# Altium project BACKPMAN21.PrjPcb (part 3 of 3)

## Sheet BACKPMAN21_PwrSw.SchDoc
size A3
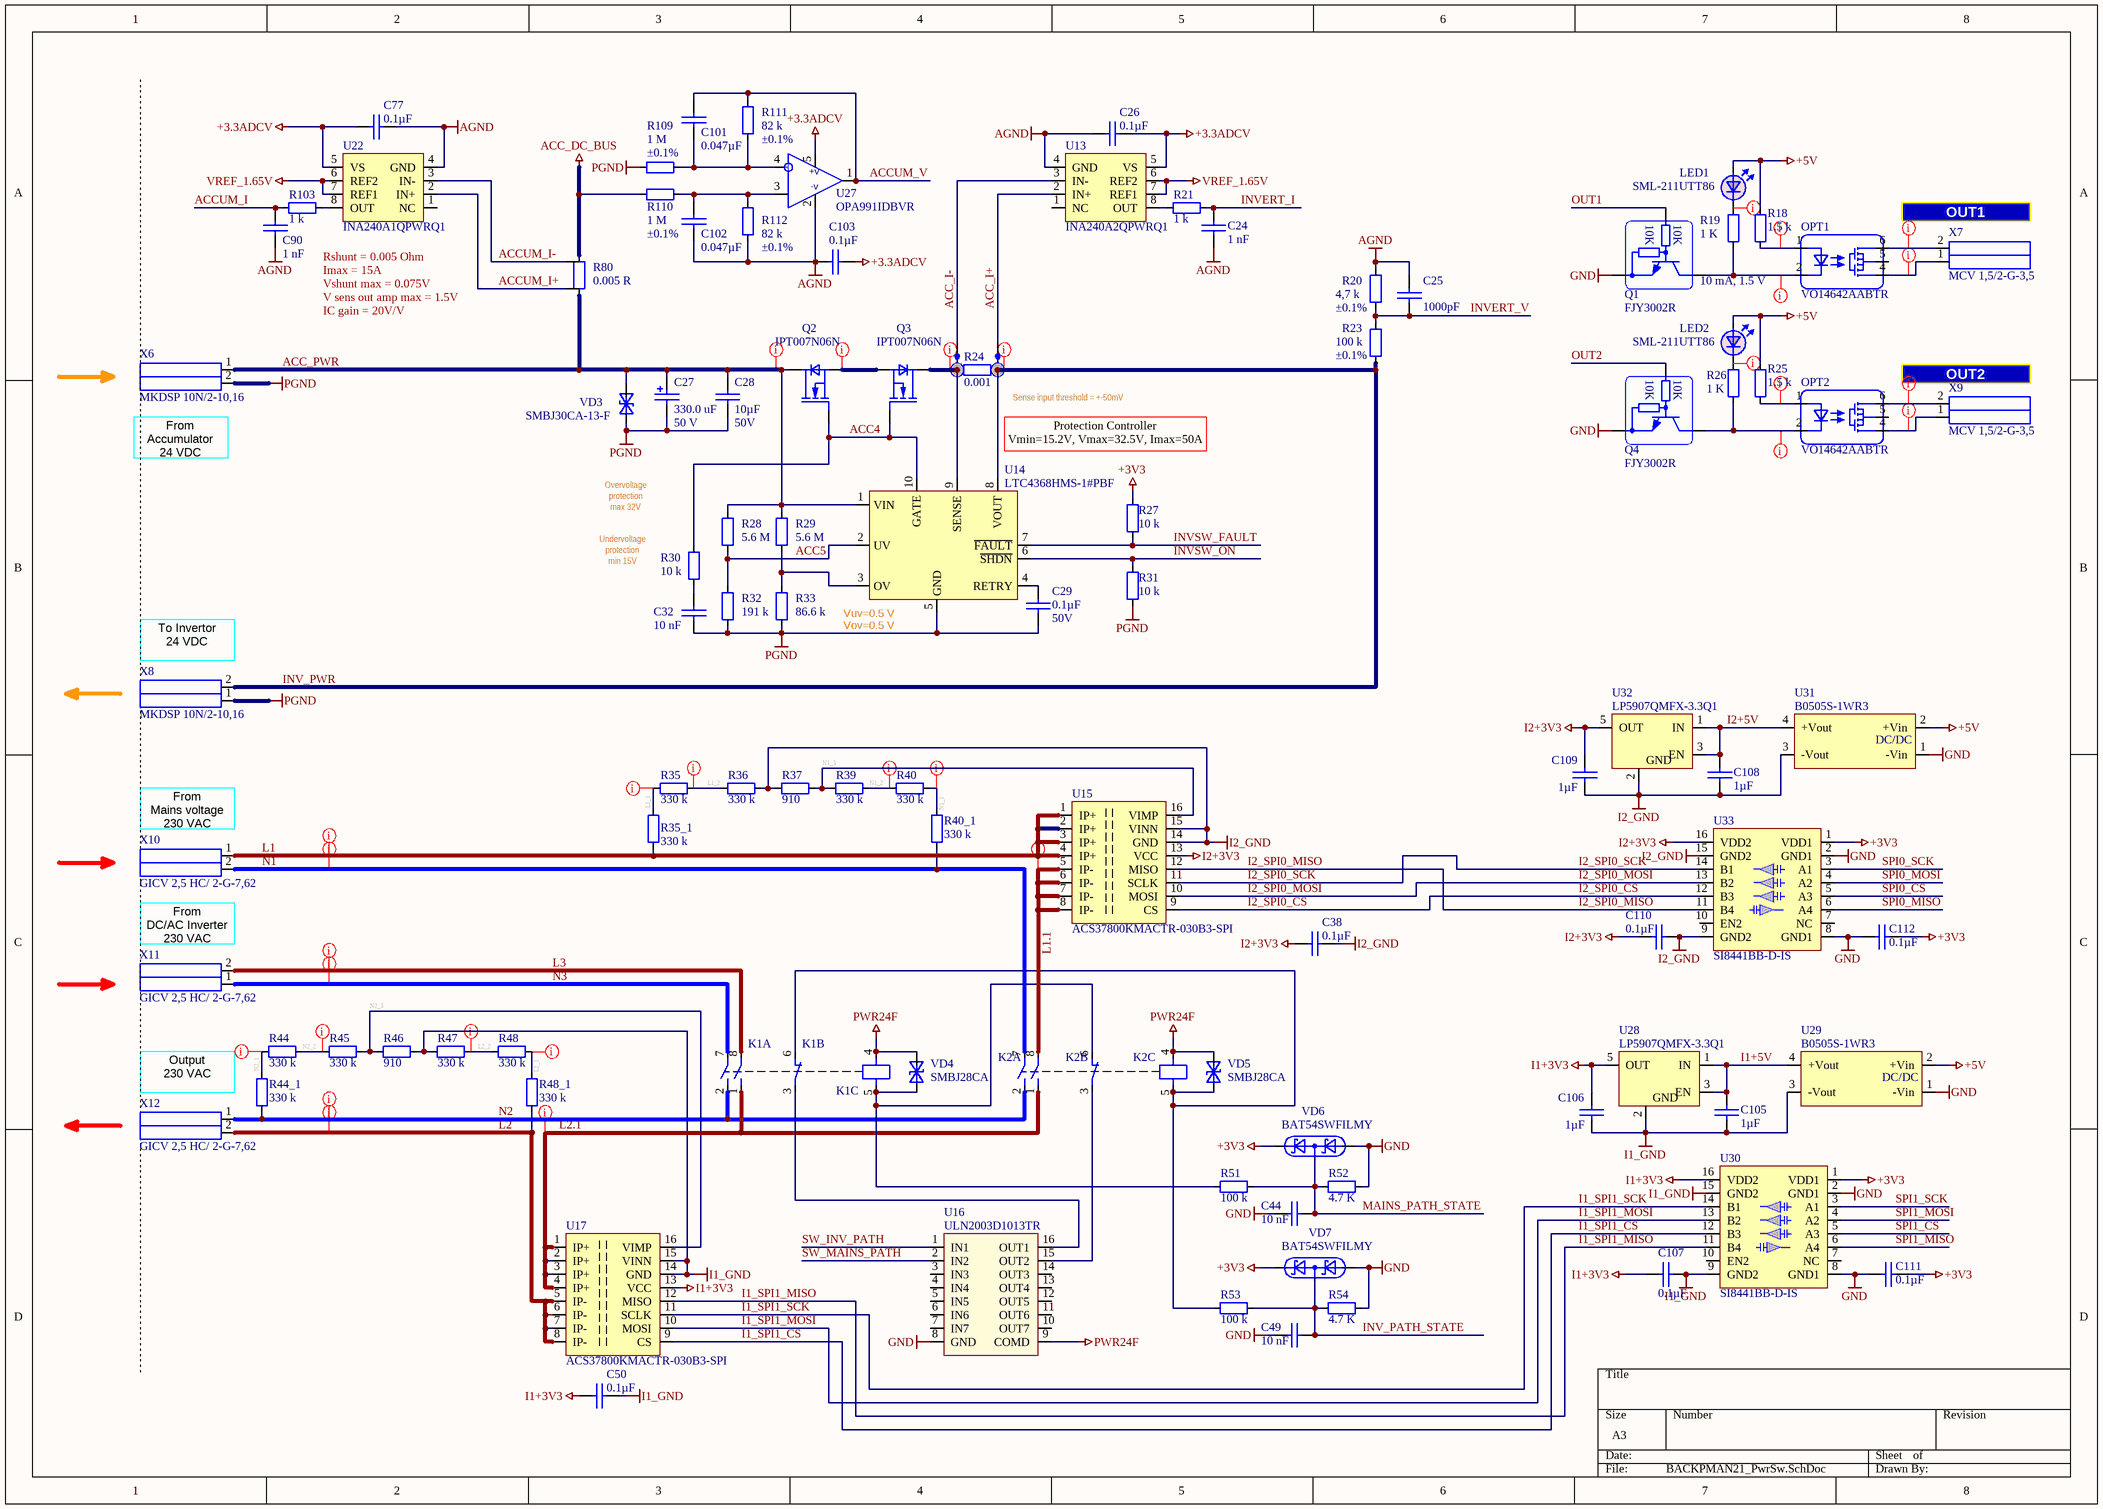
[diagram p3: BACKPMAN21_PwrSw.SchDoc]

### Parts
B1  Net tie 0.3mm  [Net tee 0.3 mm]  (value not drawn)  (net tie, no BOM)
B2  Net tie 0.3mm  [Net tee 0.3 mm]  (value not drawn)  (net tie, no BOM)
C24  value 1 nF  [0603 CAP]  (hidden comment: Capacitor)
C25  value 1000pF  [0603 CAP]  (hidden comment: Capacitor)
C26  value 0.1µF  [0603 CAP]  (hidden comment: Capacitor)
C27  value 330.0 uF  Voltage: 50 V  [UUD1V331MNL1GS]  (hidden comment: EEE-FT1H331GP)
C28  value 10µF  Voltage - Rated: 50V  [1210 CAP]  (hidden comment: Capacitor)
C29  value 0.1µF  Voltage - Rated: 50V  [0603 CAP]  (hidden comment: Capacitor)
C32  value 10 nF  [1608[0603]]  (hidden comment: CVNF010K0603)
C38  value 0.1µF  [0603 CAP]  (hidden comment: Capacitor)
C44  value 10 nF  [1608[0603]]  (hidden comment: CVNF010K0603)
C49  value 10 nF  [1608[0603]]  (hidden comment: CVNF010K0603)
C50  value 0.1µF  [0603 CAP]  (hidden comment: Capacitor)
C77  value 0.1µF  [0603 CAP]  (hidden comment: Capacitor)
C90  value 1 nF  [0603 CAP]  (hidden comment: Capacitor)
C101  value 0.047µF  [0603 CAP]  (hidden comment: Capacitor)
C102  value 0.047µF  [0603 CAP]  (hidden comment: Capacitor)
C103  value 0.1µF  [0603 CAP]  (hidden comment: Capacitor)
C105  value 1µF  [0603 CAP]  (hidden comment: Capacitor)
C106  value 1µF  [0603 CAP]  (hidden comment: Capacitor)
C107  value 0.1µF  [0603 CAP]  (hidden comment: Capacitor)
C108  value 1µF  [0603 CAP]  (hidden comment: Capacitor)
C109  value 1µF  [0603 CAP]  (hidden comment: Capacitor)
C110  value 0.1µF  [0603 CAP]  (hidden comment: Capacitor)
C111  value 0.1µF  [0603 CAP]  (hidden comment: Capacitor)
C112  value 0.1µF  [0603 CAP]  (hidden comment: Capacitor)
K1  AHES4292  [AHES4292]  (value not drawn)  (parts A,B,C of 3)
K2  AHES4292  [AHES4292]  (value not drawn)  (parts A,B,C of 3)
LED1  SML-211UTT86  [0805 LED]
LED2  SML-211UTT86  [0805 LED]
OPT1  VO14642AABTR  [DIP-6 SMD]
OPT2  VO14642AABTR  [DIP-6 SMD]
Q1  FJY3002R  [SOT-523F]
Q2  IPT007N06N  [PG-HSOF-8-1 (8-PowerSFN) Infineon]
Q3  IPT007N06N  [PG-HSOF-8-1 (8-PowerSFN) Infineon]
Q4  FJY3002R  [SOT-523F]
R18  value 1.5 k  [0603]  (hidden comment: Resistor)
R19  value 1 K  [0603]  (hidden comment: RL0603K001-1)
R20  value 4,7 k  Tolerance: ±0.1%  [0603]  (hidden comment: Resistor)
R21  value 1 k  [0603]  (hidden comment: Resistor)
R23  value 100 k  Tolerance: ±0.1%  [1206]  (hidden comment: Resistor)
R24  value 0.001  [WSR52L000FEA]  (hidden comment: WSR51L000FEA)
R25  value 1.5 k  [0603]  (hidden comment: Resistor)
R26  value 1 K  [0603]  (hidden comment: RL0603K001-1)
R27  value 10 k  [0603]  (hidden comment: Resistor)
R28  value 5.6 M  [0805]  (hidden comment: Resistor)
R29  value 5.6 M  [0805]  (hidden comment: Resistor)
R30  value 10 k  [0603]  (hidden comment: Resistor)
R31  value 10 k  [0603]  (hidden comment: Resistor)
R32  value 191 k  [0603]  (hidden comment: Resistor)
R33  value 86.6 k  [0603]  (hidden comment: Resistor)
R35  value 330 k  [1206]  (hidden comment: Resistor)
R35_1  value 330 k  [1206]  (hidden comment: Resistor)
R36  value 330 k  [1206]  (hidden comment: Resistor)
R37  value 910  [0603]  (hidden comment: Resistor)
R39  value 330 k  [1206]  (hidden comment: Resistor)
R40  value 330 k  [1206]  (hidden comment: Resistor)
R40_1  value 330 k  [1206]  (hidden comment: Resistor)
R44  value 330 k  [1206]  (hidden comment: Resistor)
R44_1  value 330 k  [1206]  (hidden comment: Resistor)
R45  value 330 k  [1206]  (hidden comment: Resistor)
R46  value 910  [0603]  (hidden comment: Resistor)
R47  value 330 k  [1206]  (hidden comment: Resistor)
R48  value 330 k  [1206]  (hidden comment: Resistor)
R48_1  value 330 k  [1206]  (hidden comment: Resistor)
R51  value 100 k  [1206]  (hidden comment: Resistor)
R52  value 4.7 K  [0603]  (hidden comment: RL0603K004.7-1)
R53  value 100 k  [1206]  (hidden comment: Resistor)
R54  value 4.7 K  [0603]  (hidden comment: RL0603K004.7-1)
R80  value 0.005 R  [FC4L110]  (hidden comment: FC4L110R005FER)
R103  value 1 k  [0603]  (hidden comment: Resistor)
R109  value 1 M  Tolerance: ±0.1%  [0603]  (hidden comment: Resistor)
R110  value 1 M  Tolerance: ±0.1%  [0603]  (hidden comment: Resistor)
R111  value 82 k  Tolerance: ±0.1%  [0603]  (hidden comment: Resistor)
R112  value 82 k  Tolerance: ±0.1%  [0603]  (hidden comment: Resistor)
U13  INA240A2QPWRQ1  [TI TSSOP-8]
U14  LTC4368HMS-1#PBF  [10-Lead Plastic MSOP Linear]
U15  ACS37800KMACTR-030B3-SPI  [16-Pin SOICW]
U16  ULN2003D1013TR  [SO-16]
U17  ACS37800KMACTR-030B3-SPI  [16-Pin SOICW]
U22  INA240A1QPWRQ1  [TI TSSOP-8]
U27  OPA991IDBVR  [SOT23-5]
U28  LP5907QMFX-3.3Q1  [SOT23-5]
U29  B0505S-1WR3  [Recom 4-SIP module]
U30  SI8441BB-D-IS  [SO-G16/D10.4]
U31  B0505S-1WR3  [Recom 4-SIP module]
U32  LP5907QMFX-3.3Q1  [SOT23-5]
U33  SI8441BB-D-IS  [SO-G16/D10.4]
VD3  SMBJ30CA-13-F  [DO-214AA_SMBJ BI]
VD4  SMBJ28CA  [DO-214AA_SMBJ]
VD5  SMBJ28CA  [DO-214AA_SMBJ]
VD6  BAT54SWFILMY  [SOT323-3]
VD7  BAT54SWFILMY  [SOT323-3]
X6  MKDSP 10N/2-10,16  [MKDSP 10N/ 2-10,16]
X7  MCV 1,5/2-G-3,5  [mcv1.5-2-g_3.5 Green  + MC 1,5 2-ST-3,5 - 1840366]
X8  MKDSP 10N/2-10,16  [MKDSP 10N/ 2-10,16]
X9  MCV 1,5/2-G-3,5  [mcv1.5-2-g_3.5 Green  + MC 1,5 2-ST-3,5 - 1840366]
X10  GICV 2,5 HC/ 2-G-7,62  [1756485 GICV 2,5 HC/2 -G-7,62]
X11  GICV 2,5 HC/ 2-G-7,62  [1756485 GICV 2,5 HC/2 -G-7,62]
X12  GICV 2,5 HC/ 2-G-7,62  [1756485 GICV 2,5 HC/2 -G-7,62]

### Nets
+3.3ADCV: C26.1 C77.1 C103.1 U13.5(VS) U22.5(VS) U27.5(V+)
+3V3: C111.2 C112.2 R27.2 U30.1(VDD1) U33.1(VDD1) VD6.2 VD7.2
+5V: LED1.1 LED2.1 R18.1 R25.1 U29.2(+Vin) U31.2(+Vin)
ACC_DC_BUS: R80.2 R110.1
AGND: C24.1 C25.1 C26.2 C77.2 C90.1 C102.2 C103.2 R20.1 R112.1 U13.4(GND) U22.4(GND) U27.2(GND)
GND: C44.2 C49.2 C111.1 C112.1 Q1.2(E) Q4.2(E) R52.1 R54.1 U16.8(GND) U29.1(-Vin) U30.2(GND1) U30.8(GND1) U31.1(-Vin) U33.2(GND1) U33.8(GND1) VD6.1 VD7.1
I1+3V3: C50.1 C106.1 C107.2 U17.13(VCC) U28.5(OUT) U30.16(VDD2)
I1_GND: C50.2 C105.2 C106.2 C107.1 R46.2 R47.1 U17.14(GND) U17.15(VINN) U28.2(GND) U29.3(-Vout) U30.9(GND2) U30.15(GND2)
I2+3V3: C38.1 C109.1 C110.2 U15.13(VCC) U32.5(OUT) U33.16(VDD2)
I2_GND: C38.2 C108.2 C109.2 C110.1 R36.2 R37.1 U15.14(GND) U15.15(VINN) U31.3(-Vout) U32.2(GND) U33.9(GND2) U33.15(GND2)
PGND: C27.2 C28.2 C29.2 C32.2 R31.1 R32.1 R33.1 R109.1 U14.5(GND) VD3.1(C) X6.2 X8.1
PWR24F: K1.4 K2.4 U16.9(COMD) VD4.2(A) VD5.2(A)
VREF_1.65V: U13.6(REF2) U13.7(REF1) U22.6(REF2) U22.7(REF1)
ACC4: Q2.1(G) Q3.1(G) R30.1 U14.10(GATE)
ACC5: R28.1 R32.2 U14.2(UV)
ACC_I+: B2.2 U13.2(IN+)
ACC_I-: B1.2 U13.3(IN-)
ACC_PWR: C27.1 C28.1 Q2.3(D) R28.2 R29.2 R80.1 U14.1(VIN) VD3.2(A) X6.1
ACCUM_I: C90.2 R103.2
ACCUM_I+: R80.3 U22.2(IN+)
ACCUM_I-: R80.4 U22.3(IN-)
ACCUM_V: C101.1 R111.2 U27.1(OUT)
I1+5V: C105.1 U28.1(IN) U28.3(EN) U29.4(+Vout)
I1_SPI1_CS: U17.9(CS) U30.12(B3)
I1_SPI1_MISO: U17.12(MISO) U30.11(B4)
I1_SPI1_MOSI: U17.10(MOSI) U30.13(B2)
I1_SPI1_SCK: U17.11(SCLK) U30.14(B1)
I2+5V: C108.1 U31.4(+Vout) U32.1(IN) U32.3(EN)
I2_SPI0_CS: U15.9(CS) U33.12(B3)
I2_SPI0_MISO: U15.12(MISO) U33.11(B4)
I2_SPI0_MOSI: U15.10(MOSI) U33.13(B2)
I2_SPI0_SCK: U15.11(SCLK) U33.14(B1)
INV_PATH_STATE: C49.1 R53.2 R54.2 VD7.3
INV_PWR: B2.1 R23.2 R24.1 U14.8(VOUT) X8.2
INVERT_I: C24.2 R21.2
INVERT_V: C25.2 R20.2 R23.1
INVSW_FAULT: R27.1 U14.7(~{FAULT})
INVSW_ON: R31.2 U14.6(~{SHDN})
L1: R35_1.1 U15.1(IP+) U15.2(IP+) U15.3(IP+) U15.4(IP+) X10.1
L1.1: K2.8 U15.5(IP-) U15.6(IP-) U15.7(IP-) U15.8(IP-)
L1_1: R35.1 R35_1.2
L1_2: R35.2 R36.1
L2: R48_1.1 U17.5(IP-) U17.6(IP-) U17.7(IP-) U17.8(IP-) X12.2
L2.1: K1.1 K2.1 U17.1(IP+) U17.2(IP+) U17.3(IP+) U17.4(IP+)
L2_1: R48.2 R48_1.2
L2_2: R47.2 R48.1
L3: K1.8 X11.2
MAINS_PATH_STATE: C44.1 R51.2 R52.2 VD6.3
N1: K2.7 R40_1.1 X10.2
N1_1: R40.2 R40_1.2
N1_2: R39.2 R40.1
N1_3: R37.2 R39.1 U15.16(VIMP)
N2: K1.2 K2.2 R44_1.1 X12.1
N2_1: R44.1 R44_1.2
N2_2: R44.2 R45.1
N2_3: R45.2 R46.1 U17.16(VIMP)
N3: K1.7 X11.1
OUT1: Q1.1(B)
OUT2: Q4.1(B)
SPI0_CS: U33.5(A3)
SPI0_MISO: U33.6(A4)
SPI0_MOSI: U33.4(A2)
SPI0_SCK: U33.3(A1)
SPI1_CS: U30.5(A3)
SPI1_MISO: U30.6(A4)
SPI1_MOSI: U30.4(A2)
SPI1_SCK: U30.3(A1)
SW_INV_PATH: U16.1(IN1)
SW_MAINS_PATH: U16.2(IN2)
NetB1_1: B1.1 Q3.3(D) R24.2 U14.9(SENSE)
NetC29_1: C29.1 U14.4(RETRY)
NetC32_1: C32.1 R30.2
NetC101_2: C101.2 R109.2 R111.1 U27.4(IN-)
NetC102_1: C102.1 R110.2 R112.2 U27.3(IN+)
NetK1_3: K1.3 U16.16(OUT1)
NetK1_5: K1.5 K2.6 R51.1 VD4.1(C)
NetK1_6: K1.6 K2.5 R53.1 VD5.1(C)
NetK2_3: K2.3 U16.15(OUT2)
NetLED1_2: LED1.2 R19.2
NetLED2_2: LED2.2 R26.2
NetOPT1_1: OPT1.1 R18.2
NetOPT1_2: OPT1.2 Q1.3(C) R19.1
NetOPT1_4: OPT1.4 X7.1
NetOPT1_6: OPT1.6 X7.2
NetOPT2_1: OPT2.1 R25.2
NetOPT2_2: OPT2.2 Q4.3(C) R26.1
NetOPT2_4: OPT2.4 X9.1
NetOPT2_6: OPT2.6 X9.2
NetQ2_2: Q2.2(S) Q3.2(S)
NetR21_1: R21.1 U13.8(OUT)
NetR29_1: R29.1 R33.2 U14.3(OV)
NetR103_1: R103.1 U22.8(OUT)

Not connected (* = marked no-connect by the designer): OPT1 5; OPT2 5; U13 1(NC); U16 3(IN3) 4(IN4) 5(IN5) 6(IN6) 7(IN7) 10(OUT7) 11(OUT6) 12(OUT5) 13(OUT4) 14(OUT3); U22 1(NC); U30 7(NC) 10(EN2); U33 7(NC) 10(EN2)

### Layout directives
net class 24V: ACC_PWR, INV_PWR, NetB1_1, NetOPT1_4, NetOPT1_6, NetOPT2_4, NetOPT2_6, NetQ2_2
net class 5V: NetLED1_2, NetLED2_2, NetOPT1_1, NetOPT1_2, NetOPT2_1, NetOPT2_2
net class 220V: L1, L1.1, L1_1, L1_2, L2, L2.1, L2_1, L2_2, L3, N1, N1_1, N1_2, N2, N2_1, N2_2, N3

### Notes on the sheet
- OUT1
- Rshunt = 0.005 Ohm
  Imax = 15A
  Vshunt max = 0.075V
  V sens out amp max = 1.5V
  IC gain = 20V/V
- (near Q1) 10 mA, 1.5 V
- OUT2
- (near X6) From
  Accumulator
  24 VDC
- Protection Controller
  Vmin=15.2V, Vmax=32.5V, Imax=50A
- Sense input threshold = +-50mV
- Overvoltage protection
  max 32V
- Undervoltage protection
  min 15V
- (near U14) Vuv=0.5 V
  Vov=0.5 V
- (near X8) To Invertor
  24 VDC
- (near X10) From
  Mains voltage
  230 VAC
- From
  DC/AC Inverter
  230 VAC
- Output
  230 VAC
- (in symbol B0505S-1WR3) DC/DC
- (in symbol FJY3002R) 10K
- (in symbol OPA991IDBVR) +v; -v

### Library data of the parts
C24 C90 = CC0603JRX7R9BB102: 1000pF, ±5%, 50V, X7R, 0603 (1608 Metric), -55°C ~ 125°C, -, General Purpose; Manufacturer: Yageo; PartNum: 311-3361-1-ND; Voltage - Rated: 50V; Part Number: CC0603JRX7R9BB102; Distributor: Digi-Key; PartName: CC0603JRX7R9BB102; Price: 0.01920; Tolerance: ±5%; Temperature Coefficient: X7R; Operating Temperature: -55°C ~ 125°C; Features: -; Package / Case: 0603 (1608 Metric)
C25 = 885012206034: 1000pF, ±10%, 16V, X7R, 0603 (1608 Metric), -55°C ~ 125°C, -, General Purpose; Manufacturer: Wurth Electronics Inc.; PartNum: 732-7953-1-ND; Voltage - Rated: 16V; Part Number: 885012206034; Distributor: Digi-Key; PartName: 885012206034; Price: 0.01920; Tolerance: ±10%; Temperature Coefficient: X7R; Operating Temperature: -55°C ~ 125°C; Features: -; Package / Case: 0603 (1608 Metric)
C26 C29 C77 C103 = GCM188L81H104KA57D: 0.1µF, ±10%, 50V, X8L, 0603 (1608 Metric), -55°C ~ 150°C, -, Automotive; Manufacturer: Murata Electronics North America; PartNum: 490-6049-1-ND; Part Number: GCM188L81H104KA57D; Distributor: Digi-Key; PartName: GCM188L81H104KA57D; Price: 0.06240; Tolerance: ±10%; Temperature Coefficient: X8L; Operating Temperature: -55°C ~ 150°C; Features: -; Package / Case: 0603 (1608 Metric)
  C26 C77 C103: Voltage - Rated: 50V
C27 = EEE-FT1H331GP: 330 uF, 50V, 120 mOhm @ 100kHz, 585 mA, 10x10, -50...+105 C; Manufacturer: Panasonic Electronic Components; Tolerance: ±20%; Distributor: Digi-Key; Price: 1.22$; PartNum: EEE-FT1H331GP; PartName: EEE-FT1H331GP
C28 = C3225X7S1H106K250AB: 10µF, ±10%, 50V, X7S, 1210 (3225 Metric), -55°C ~ 125°C, Low ESL, General Purpose; Manufacturer: TDK Corporation; PartNum: 445-4536-1-ND; Part Number: C3225X7S1H106K250AB; Distributor: Digi-Key; PartName: C3225X7S1H106K250AB; Price: 0.71160; Tolerance: ±10%; Temperature Coefficient: X7S; Operating Temperature: -55°C ~ 125°C; Features: Low ESL; Package / Case: 1210 (3225 Metric)
C32 C44 C49 = CVNF010K0603: 10 nF, 50V, 10%, X7R, 0603 SMD MLC Capacitor; Manufacturer: Murata Electronics; PartNum: 490-1512-1-ND; PartName: GRM188R71H103KA01D; Tolerance: ±10%; Distributor: Digi-Key; Voltage: 50 V
C38 C50 C107 C110-C112 = CL10B104KO8NNNC: 0.1µF, ±10%, 16V, X7R, 0603 (1608 Metric), -55°C ~ 125°C, -, General Purpose; Manufacturer: Samsung Electro-Mechanics; PartNum: 1276-1005-1-ND; Voltage - Rated: 16V; Part Number: CL10B104KO8NNNC; Distributor: Digi-Key; PartName: CL10B104KO8NNNC; Price: 0.01480; Tolerance: ±10%; Temperature Coefficient: X7R; Operating Temperature: -55°C ~ 125°C; Features: -; Package / Case: 0603 (1608 Metric)
C101 C102 = CC0603JRX7R9BB473: 0.047µF, ±5%, 50V, X7R, 0603 (1608 Metric), -55°C ~ 125°C, -, General Purpose; Manufacturer: Yageo; PartNum: 311-4019-1-ND; Part Number: CC0603JRX7R9BB473; Distributor: Digi-Key; PartName: CC0603JRX7R9BB473; Price: 0.03660; Tolerance: ±5%; Voltage - Rated: 50V; Temperature Coefficient: X7R; Operating Temperature: -55°C ~ 125°C; Features: -; Package / Case: 0603 (1608 Metric)
C105 C106 C108 C109 = CL10B105KO8NNNC: 1µF, ±10%, 16V, X7R, 0603 (1608 Metric), -55°C ~ 125°C, -, General Purpose; Manufacturer: Samsung Electro-Mechanics; PartNum: 1276-1019-1-ND; Voltage - Rated: 16V; Part Number: CL10B105KO8NNNC; Distributor: Digi-Key; PartName: CL10B105KO8NNNC; Price: 0.02250; Tolerance: ±10%; Temperature Coefficient: X7R; Operating Temperature: -55°C ~ 125°C; Features: -; Package / Case: 0603 (1608 Metric)
K1 K2 = AHES4292: General Purpose Relay 3PST-2NO/1NC (2 Form A, 1 Form B) 24VDC Coil Through Hole, Coil Resistance 306 Ohms, Contact Rating (Current) 35A, -40°C ~ 55°C; PartNum: 255-5914-ND; Manufacturer: Panasonic Electric Works; Distributor: Digi-Key; Price: 21.7; PartName: AHES4292
LED1 LED2 = SML-211UTT86: 0805 red LED, hibright, 2 mA, 1.8V, 130°; Manufacturer: Rohm; PartNum: 511-1292-1-ND; Distributor: Digi-Key; Price: 0.34$; Value: Red; PartName: SML-211UTT86
OPT1 OPT2 = VO14642AABTR: Opto relay, SPST-NO, AC DC, 250 mOhm, 2A, 0-60V, 6-SMD, -55..50C; Manufacturer: Vishay Semiconductor Opto Division; PartNum: VO14642AABCT-ND; Distributor: DigiKey; Price: 2.9$; PartName: VO14642AABTR
Q1 Q4 = FJY3002R: NPN 50V 100MA SOT-523F; Manufacturer: Fairchild Semiconductor; PartNum: FJY3002RCT-ND; Price: 0.11$; Distributor: Digi-Key
Q2 Q3 = IPT007N06NATMA1: MOSFET N CH 60V 300A, 0.75 mOhm @ 150A 10V, 287nC @ 10V, PG-HSOF-8-1, -55°C ~ 175°C; Manufacturer: Infineon Technologies; PartNum: IPT007N06NATMA1CT-ND; Price: 5.9$; Distributor: Digi-Key; PartName: IPT007N06NATMA1
R18 R25 = RMCF0603FT1K50: 1.5 kOhms, ±1%, 0.1W, 1/10W, Thick Film, ±100ppm/°C, 0603 (1608 Metric), -55°C ~ 155°C, Automotive AEC-Q200; Manufacturer: Stackpole Electronics Inc.; PartNum: RMCF0603FT1K50CT-ND; Voltage: 75V; Distributor: Digi-Key; Price: 0.00690; Tolerance: ±1%; PartName: RMCF0603FT1K50; Part Number: RMCF0603FT1K50; Temperature Coefficient: ±100ppm/°C; Operating Temperature: -55°C ~ 155°C; Power (Watts): 0.1W, 1/10W; Features: Automotive AEC-Q200; Package / Case: 0603 (1608 Metric)
R19 R26 = RL0603K001-1: 1 K, 1%, 0603, SMD Resistor, Taped; Manufacturer: Vishay; Voltage: 75 V; Distributor: Schukat; Price: 0.002 Euro; Tolerance: 1%; PartNum: RL0603K001-1
R20 = ERA-3AEB472V: 4,7 kOhms, ±0.1%, 0.1W, 1/10W, Thin Film, ±25ppm/°C, 0603 (1608 Metric), -55°C ~ 155°C, Automotive AEC-Q200; Manufacturer: Panasonic Electronic Components; PartNum: P4.7KDBCT-ND; Voltage: 75V; Distributor: Digi-Key; Price: 0.26; PartName: ERA-3AEB472V; Part Number: ERA-3AEB472V; Temperature Coefficient: ±25ppm/°C; Operating Temperature: -55°C ~ 155°C; Power (Watts): 0.1W, 1/10W; Features: Automotive AEC-Q200; Package / Case: 0603 (1608 Metric)
R21 R103 = RMCF0603FG1K00: 1 kOhms, ±1%, 0.1W, 1/10W, Thick Film, ±100ppm/°C, 0603 (1608 Metric), -55°C ~ 155°C, Automotive AEC-Q200; Manufacturer: Stackpole Electronics Inc.; PartNum: RMCF0603FG1K00CT-ND; Voltage: 75V; Distributor: Digi-Key; Price: 0.00690; Tolerance: ±1%; PartName: RMCF0603FG1K00; Part Number: RMCF0603FG1K00; Temperature Coefficient: ±100ppm/°C; Operating Temperature: -55°C ~ 155°C; Power (Watts): 0.1W, 1/10W; Features: Automotive AEC-Q200; Package / Case: 0603 (1608 Metric)
R23 = RMCF1206FT100K: 100 kOhms, ±0.1%, 0.25W, 1/4W, Thick Film, ±15ppm/°C, 1206 (3216 Metric), -55°C ~ 155°C, Automotive AEC-Q200; Manufacturer: Panasonic Electronic Components; PartNum: ERA-8APB104V; Voltage: 200V; Distributor: Digi-Key; Price: 0.88$; PartName: ERA-8APB104V; Part Number: ERA-8APB104V; Temperature Coefficient: ±15ppm/°C; Operating Temperature: -55°C ~ 155°C; Power (Watts): 0.25W, 1/4W; Features: Automotive AEC-Q200; Package / Case: 1206 (3216 Metric)
R24 = WSR51L000FEA: Curr.sens.res. 0.001 OHM 5W 1% 4527 SMD; Manufacturer: Vishay/Dale; PartNum: WSRC-.001CT-ND; Distributor: Digi-Key; Price: 5.27$; Tolerance: 1%; PartName: WSR51L000FEA
R27 R30 R31 = CR0603-FX-1002GLF: 10 kOhms, ±1%, 0.1W, 1/10W, Thick Film, ±100ppm/°C, 0603 (1608 Metric), -55°C ~ 155°C, Moisture Resistant; Manufacturer: Bourns Inc.; PartNum: CR0603-FX-1002GLFCT-ND; Voltage: 75V; Distributor: Digi-Key; Price: 0.00860; Tolerance: ±1%; PartName: CR0603-FX-1002GLF; Part Number: CR0603-FX-1002GLF; Temperature Coefficient: ±100ppm/°C; Operating Temperature: -55°C ~ 155°C; Power (Watts): 0.1W, 1/10W; Features: Moisture Resistant; Package / Case: 0603 (1608 Metric)
R28 R29 = CRCW08055M60FKEA: 5.6 MOhms, ±1%, 0.125W, 1/8W, Thick Film, ±100ppm/°C, 0805 (2012 Metric), -55°C ~ 155°C, Automotive AEC-Q200; Manufacturer: Vishay Dale; PartNum: 541-5.60MCCT-ND; Voltage: 150V; Distributor: Digi-Key; Price: 0.02230; Tolerance: ±1%; PartName: CRCW08055M60FKEA; Part Number: CRCW08055M60FKEA; Temperature Coefficient: ±100ppm/°C; Operating Temperature: -55°C ~ 155°C; Power (Watts): 0.125W, 1/8W; Features: Automotive AEC-Q200; Package / Case: 0805 (2012 Metric)
R32 = RMCF0603FT191K: 191 kOhms, ±1%, 0.1W, 1/10W, Thick Film, ±100ppm/°C, 0603 (1608 Metric), -55°C ~ 155°C, Automotive AEC-Q200; Manufacturer: Stackpole Electronics Inc.; PartNum: RMCF0603FT191KCT-ND; Voltage: 75V; Distributor: Digi-Key; Price: 0.00690; Tolerance: ±1%; PartName: RMCF0603FT191K; Part Number: RMCF0603FT191K; Temperature Coefficient: ±100ppm/°C; Operating Temperature: -55°C ~ 155°C; Power (Watts): 0.1W, 1/10W; Features: Automotive AEC-Q200; Package / Case: 0603 (1608 Metric)
R33 = RMCF0603FT86K6: 86.6 kOhms, ±1%, 0.1W, 1/10W, Thick Film, ±100ppm/°C, 0603 (1608 Metric), -55°C ~ 155°C, Automotive AEC-Q200; Manufacturer: Stackpole Electronics Inc.; PartNum: RMCF0603FT86K6CT-ND; Voltage: 75V; Distributor: Digi-Key; Price: 0.00690; Tolerance: ±1%; PartName: RMCF0603FT86K6; Part Number: RMCF0603FT86K6; Temperature Coefficient: ±100ppm/°C; Operating Temperature: -55°C ~ 155°C; Power (Watts): 0.1W, 1/10W; Features: Automotive AEC-Q200; Package / Case: 0603 (1608 Metric)
R35 R35_1 R36 R39 R40 R40_1 R44 R44_1 R45 R47 R48 R48_1 = RMCF1206FT330K: 330 kOhms, ±1%, 0.25W, 1/4W, Thick Film, ±100ppm/°C, 1206 (3216 Metric), -55°C ~ 155°C, Automotive AEC-Q200; Manufacturer: Stackpole Electronics Inc.; PartNum: RMCF1206FT330KCT-ND; Voltage: 200V; Distributor: Digi-Key; Price: 0.01500; Tolerance: ±1%; PartName: RMCF1206FT330K; Part Number: RMCF1206FT330K; Temperature Coefficient: ±100ppm/°C; Operating Temperature: -55°C ~ 155°C; Power (Watts): 0.25W, 1/4W; Features: Automotive AEC-Q200; Package / Case: 1206 (3216 Metric)
R37 R46 = RMCF0603FT910R: 910 Ohms, ±1%, 0.1W, 1/10W, Thick Film, ±100ppm/°C, 0603 (1608 Metric), -55°C ~ 155°C, Automotive AEC-Q200; Manufacturer: Stackpole Electronics Inc.; PartNum: RMCF0603FT910RCT-ND; Voltage: 75V; Distributor: Digi-Key; Price: 0.00690; Tolerance: ±1%; PartName: RMCF0603FT910R; Part Number: RMCF0603FT910R; Temperature Coefficient: ±100ppm/°C; Operating Temperature: -55°C ~ 155°C; Power (Watts): 0.1W, 1/10W; Features: Automotive AEC-Q200; Package / Case: 0603 (1608 Metric)
R51 R53 = RMCF1206FT100K: 100 kOhms, ±1%, 0.25W, 1/4W, Thick Film, ±100ppm/°C, 1206 (3216 Metric), -55°C ~ 155°C, Automotive AEC-Q200; Manufacturer: Stackpole Electronics Inc.; PartNum: RMCF1206FT100KCT-ND; Voltage: 200V; Distributor: Digi-Key; Price: 0.01410; Tolerance: ±1%; PartName: RMCF1206FT100K; Part Number: RMCF1206FT100K; Temperature Coefficient: ±100ppm/°C; Operating Temperature: -55°C ~ 155°C; Power (Watts): 0.25W, 1/4W; Features: Automotive AEC-Q200; Package / Case: 1206 (3216 Metric)
R52 R54 = RL0603K004.7-1: 4.7 K, 1%, 0603, SMD Resistor, Taped; Manufacturer: Vishay Dale; PartNum: 541-4.7KGDKR-ND; PartName: CRCW06034K70JNEA; Voltage: 75 V; Distributor: Digi-Key; Tolerance: 1%
R80 = FC4L110R005FER: Curr.sens.res. 0.005 OHM 5W 1% , 4320 (50110 Metric); Manufacturer: Ohmite; PartNum: 588-FC4L110R005FER; Distributor: Digi-Key; Price: 2.42; Tolerance: 1%; PartName: FC4L110R005FER
R109 R110 = RT0603BRD071ML: 1 MOhms, ±0.1%, 0.1W, 1/10W, Thin Film, ±25ppm/°C, 0603 (1608 Metric), -55°C ~ 155°C, -; Manufacturer: Yageo; PartNum: YAG4498CT-ND; Voltage: 75V; Distributor: Digi-Key; Price: 0.254; PartName: RT0603BRD071ML; Part Number: RT0603BRD071ML; Temperature Coefficient: ±25ppm/°C; Operating Temperature: -55°C ~ 155°C; Power (Watts): 0.1W, 1/10W; Features: -; Package / Case: 0603 (1608 Metric)
R111 R112 = ERA-3AEB823V: 82 kOhms, ±0.1%, 0.1W, 1/10W, Thin Film, ±25ppm/°C, 0603 (1608 Metric), -55°C ~ 155°C, Automotive AEC-Q200; Manufacturer: Panasonic Electronic Components; PartNum: P82KDBCT-ND; Voltage: 75V; Distributor: Digi-Key; Price: 0.26; PartName: ERA-3AEB823V; Part Number: ERA-3AEB823V; Temperature Coefficient: ±25ppm/°C; Operating Temperature: -55°C ~ 155°C; Power (Watts): 0.1W, 1/10W; Features: Automotive AEC-Q200; Package / Case: 0603 (1608 Metric)
U13 = INA240A2QPWRQ1: Current Sense Amplifier, 50V/V, 2V/us, 400KHz, -40°C ~ 125°C, 8-TSSOP; Manufacturer: Texas Instruments; PartNum: 296-50473-1-ND; Price: 3.48$; Distributor: Digi-Key; PartName: INA240A2QPWRQ1; Supplier 1: Digi-Key; Supplier Part Number 1: 296-50473-1-ND
U14 = LTC4368HMS-1_PBF: 100V UV/OV and Reverse  Protection Controller with  Bidirectional Circuit Breaker, 10-Lead Plastic MSOP, -40°C...85°C; Manufacturer: Analog Devices; PartNum: LTC4368HMS-1#PBF-ND; Distributor: Digi-Key; Price: 3.12$; PartName: LTC4368HMS-1#PBF
U15 U17 = ACS37800KMACTR-030B3-SPI: Single Phase, Isolated, AC Power Monitoring IC / with Voltage Zero Crossing and Overcurrent Detection. 517 Vrms, 90A, SPI, 3.3V,  16-SOIC (0.295", 7.50mm Width), -40°C ~ 125°C; Manufacturer: Allegro MicroSystems; PartNum: 620-ACS37800KMACTR-030B3-SPICT-ND; Price: 5.4$; Distributor: Digi-Key; PartName: ACS37800KMACTR-030B3-SPI
  U15: Supplier 1: Digi-Key; Supplier Part Number 1: 620-ACS37800KMACTR-030B3-SPICT-ND
U16 = ULN2003D1013TR: TRANS 7 NPN DARL 50V 500MA 16SO; Manufacturer: STMicroelectronics; PartNum: 497-2345-1-ND; Distributor: DigiKey; Price: 0.52$; PartName: ULN2003D1013TR
U22 = INA240A1QPWRQ1: Current Sense Amplifier, 20V/V, 2V/us, 400KHz, -40°C ~ 125°C, 8-TSSOP; Manufacturer: Texas Instruments; PartNum: 296-50472-1-ND; Price: 2.8$; Distributor: Digi-Key; PartName: INA240A1QPWRQ1; Supplier 1: Digi-Key; Supplier Part Number 1: 296-50472-1-ND
U27 = OPA991IDBVR: OpAmp,  Rail-to-Rail,  4,5MHz, VSS 2.7V ~ 40V, Vofs125µV,  SOT-23-5, -40°C ~ 125°C; Manufacturer: Texas Instruments; PartNum: 296-OPA991IDBVRCT-ND; Price: 1.34$; Distributor: Digi-Key; PartName: OPA991IDBVR; Supplier 1: Digi-Key; Supplier Part Number 1: 296-OPA991IDBVRCT-ND
U28 U32 = LP5907QMFX-3.3Q1: LDO 3.3 V, 250 mA, Vin < 5.5V, Iq < 12uA, -40..+125 C, SOT23-5; Manufacturer: Texas Instruments; PartNum: 296-40365-1-ND; Distributor: Digi-Key; PartName: LP5907QMFX-3.3Q1; Supplier 1: Digi-Key; Supplier Part Number 1: 296-40365-1-ND
U29 U31 = B0505S-1WR3: 200mA, DC-DC Unregulated Single Output , 5V in, 5 V out,  -40°C ~ 105°C; Manufacturer: Mornsun America, LLC; PartNum: 2725-B0505S-1WR3-ND; Price: 1.22$; Distributor: Digi-Key; PartName: B0505S-1WR3; Supplier 1: Digi-Key; Supplier Part Number 1: 2725-B0505S-1WR3-ND
U30 U33 = SI8441BB-D-IS: IC ISOLATOR 4CH 5.5V 16-SOIC; Manufacturer: Silicon Laboratories Inc; PartNum: 336-1762-5-ND; Distributor: Digi-Key; Price: 3.46$
  U33: Supplier 1: Digi-Key; Supplier Part Number 1: 336-1762-5-ND
VD3 = SMBJ30CA-13-F: TVS 600W, Vbr=33.3V, Vcl=48.4V,  Bidirectional, SMB, -55°C ~ 150°C; Manufacturer: Diodes Incorporated; PartNum: SMBJ30CA-FDICT-ND; Distributor: Digi-Key; Price: 0.21$; PartName: SMBJ30CA-13-F
VD4 VD5 = SMBJ28CA: TVS 600W 28V Bidirectional; Manufacturer: Littelfuse; PartNum: SMBJ28CABCT-ND; Distributor: DigiKey; Price: 0.38$; PartName: SMBJ28CABCT-ND
VD6 VD7 = BAT54SWFILMY: Series Shottky Diodes array, 40V, 300 mA, SOT-323, -40°C...150°C; Manufacturer: STMicroelectronics; PartNum: 497-17757-1-ND; Distributor: Digi-Key; PartName: BAT54SWFILMY
X6 X8 = MKDSP 10N/2-10,16: TERMINAL BLOCK, PCB, 10.16MM, 2WAY; Manufacturer: PHOENIX CONTACT; PartNum: 1734796; Distributor: Farnell; Price: 2.83 Euro
X7 X9 = MCV 1,5/2-G-3,5: HEADER, VERTICAL, 3.5MM, 2WAY; Manufacturer: PHOENIX CONTACT; PartNum: 1843606; Distributor: Farnell; PartName: MCV 1,5/2-G-3,5
X10-X12 = GICV 2,5 HC/ 2-G-7,62: Header, Nominal current: 16 A, Rated voltage (III/2): 630 V, Number of positions: 2, Pitch: 7.62 mm, Color: green; Manufacturer: PHOENIX CONTACT; PartNum: 1756485; Distributor: PHOENIX CONTACT; Price: 0.66 Euro; PartName: GICV 2,5 HC/ 2-G-7,62

## Nets that join several sheets
+3.3ADCV: BACKPMAN21_CPU (C89.2 C91.1 C93.1 U1.H1), BACKPMAN21_Intfs (6 pins), BACKPMAN21_Charger (C51.1 C52.1 U18.5 U19.5), BACKPMAN21_PwrSw (6 pins)
+3V3: BACKPMAN21_CPU (23 pins), BACKPMAN21_Intfs (18 pins), BACKPMAN21_Charger (6 pins), BACKPMAN21_PwrSw (7 pins)
+5V: BACKPMAN21_Intfs (15 pins), BACKPMAN21_PwrSw (6 pins)
ACC_DC_BUS: BACKPMAN21_Charger (12 pins), BACKPMAN21_PwrSw (R80.2 R110.1)
AGND: BACKPMAN21_CPU (5 pins), BACKPMAN21_Intfs (9 pins), BACKPMAN21_Charger (10 pins), BACKPMAN21_PwrSw (12 pins)
GND: BACKPMAN21_CPU (31 pins), BACKPMAN21_Intfs (67 pins), BACKPMAN21_Charger (B7.1), BACKPMAN21_PwrSw (17 pins)
PGND: BACKPMAN21_Charger (45 pins), BACKPMAN21_PwrSw (12 pins)
PWR24F: BACKPMAN21_Intfs (C23.1 F1.2 U9.1 VD2.1), BACKPMAN21_PwrSw (5 pins)
SYS_PWR: BACKPMAN21_Intfs (F1.1), BACKPMAN21_Charger (20 pins)
VREF_1.65V: BACKPMAN21_CPU (U1.E2), BACKPMAN21_Intfs (C99.1 R108.1), BACKPMAN21_Charger (U18.6 U18.7 U19.6 U19.7), BACKPMAN21_PwrSw (U13.6 U13.7 U22.6 U22.7)
ACCUM_I: BACKPMAN21_CPU (U1.K3), BACKPMAN21_PwrSw (C90.2 R103.2)
ACCUM_I+: BACKPMAN21_Charger (R113.2), BACKPMAN21_PwrSw (R80.3 U22.2)
ACCUM_I-: BACKPMAN21_Charger (R114.2), BACKPMAN21_PwrSw (R80.4 U22.3)
ACCUM_ID_I: BACKPMAN21_CPU (U1.J3), BACKPMAN21_Charger (C94.2 R105.2)
ACCUM_V: BACKPMAN21_CPU (U1.F1), BACKPMAN21_PwrSw (C101.1 R111.2 U27.1)
AIDS_FAULT: BACKPMAN21_CPU (U1.K7), BACKPMAN21_Charger (R72.1 U21.13)
AIDS_FBC: BACKPMAN21_CPU (U1.K8), BACKPMAN21_Charger (Q9.1)
AIDS_SHDN: BACKPMAN21_CPU (U1.J8), BACKPMAN21_Charger (R78.2 U21.9)
CAN0_RX: BACKPMAN21_CPU (U1.B4), BACKPMAN21_Intfs (U10.5)
CAN0_TX: BACKPMAN21_CPU (U1.E8), BACKPMAN21_Intfs (U10.6)
CANCTRL: BACKPMAN21_CPU (U1.G10), BACKPMAN21_Intfs (U10.4)
DCDC_MODE: BACKPMAN21_CPU (U1.K6), BACKPMAN21_Charger (R115.2)
DCDC_PGOOD: BACKPMAN21_CPU (U1.J6), BACKPMAN21_Charger (R95.1)
EN_CHARGER: BACKPMAN21_CPU (U1.K5), BACKPMAN21_Charger (R101.2)
ENC_A: BACKPMAN21_CPU (U1.D9), BACKPMAN21_Intfs (P10.1 R10.1 SW1.A)
ENC_B: BACKPMAN21_CPU (U1.H6), BACKPMAN21_Intfs (P11.1 R11.1 SW1.B)
ENC_SW: BACKPMAN21_CPU (U1.J10), BACKPMAN21_Intfs (P13.1 R13.1 SW1.4)
I2C1_SCL: BACKPMAN21_CPU (U1.B5), BACKPMAN21_Charger (R98.2 U24.6)
I2C1_SDA: BACKPMAN21_CPU (U1.A5), BACKPMAN21_Charger (R97.2 U24.8)
INV_PATH_STATE: BACKPMAN21_CPU (U1.J4), BACKPMAN21_PwrSw (C49.1 R53.2 R54.2 VD7.3)
INVERT_I: BACKPMAN21_CPU (U1.K4), BACKPMAN21_PwrSw (C24.2 R21.2)
INVERT_V: BACKPMAN21_CPU (U1.F2), BACKPMAN21_PwrSw (C25.2 R20.2 R23.1)
INVSW_FAULT: BACKPMAN21_CPU (U1.H5), BACKPMAN21_PwrSw (R27.1 U14.7)
INVSW_ON: BACKPMAN21_CPU (U1.J5), BACKPMAN21_PwrSw (R31.2 U14.6)
LED_GR: BACKPMAN21_CPU (U1.A8), BACKPMAN21_Intfs (U6.2)
LED_RD: BACKPMAN21_CPU (U1.J7), BACKPMAN21_Intfs (U8.2)
LEDCAN0: BACKPMAN21_CPU (U1.G9), BACKPMAN21_Intfs (R50.2)
MAINS_PATH_STATE: BACKPMAN21_CPU (U1.H4), BACKPMAN21_PwrSw (C44.1 R51.2 R52.2 VD6.3)
OLED_CLK: BACKPMAN21_CPU (U1.A3), BACKPMAN21_Intfs (LCD1.13 P7.1)
OLED_CS: BACKPMAN21_CPU (U1.C3), BACKPMAN21_Intfs (LCD1.8 P4.1)
OLED_DC: BACKPMAN21_CPU (U1.B3), BACKPMAN21_Intfs (LCD1.10 P6.1)
OLED_DIN: BACKPMAN21_CPU (U1.E3), BACKPMAN21_Intfs (LCD1.14 P8.1 R2.1)
OLED_RES: BACKPMAN21_CPU (U1.A2), BACKPMAN21_Intfs (LCD1.9 P5.1)
OLEDP: BACKPMAN21_CPU (U1.B6), BACKPMAN21_Intfs (U34.2)
OLEDV: BACKPMAN21_CPU (U1.C6), BACKPMAN21_Intfs (U2.4)
OUT1: BACKPMAN21_CPU (U1.E10), BACKPMAN21_PwrSw (Q1.1)
OUT2: BACKPMAN21_CPU (U1.F10), BACKPMAN21_PwrSw (Q4.1)
PIDS_FAULT: BACKPMAN21_CPU (U1.K10), BACKPMAN21_Charger (R68.1 U20.13)
PIDS_SHDN: BACKPMAN21_CPU (U1.K9), BACKPMAN21_Charger (Q10.1 R76.2)
PSRC_I: BACKPMAN21_CPU (U1.G4), BACKPMAN21_Charger (C92.2 R104.2)
PSRC_V: BACKPMAN21_CPU (U1.K2), BACKPMAN21_Charger (C59.2 R61.1 R67.2)
PWR24_V: BACKPMAN21_CPU (U1.J2), BACKPMAN21_Charger (C74.2 R81.1 R83.2)
RESET: BACKPMAN21_CPU (C10.1 U1.E1), BACKPMAN21_Intfs (R17.1 X5.10)
SPI0_CS: BACKPMAN21_CPU (U1.G3), BACKPMAN21_PwrSw (U33.5)
SPI0_MISO: BACKPMAN21_CPU (U1.A6), BACKPMAN21_PwrSw (U33.6)
SPI0_MOSI: BACKPMAN21_CPU (U1.C5), BACKPMAN21_PwrSw (U33.4)
SPI0_SCK: BACKPMAN21_CPU (U1.H3), BACKPMAN21_PwrSw (U33.3)
SPI1_CS: BACKPMAN21_CPU (U1.A4), BACKPMAN21_PwrSw (U30.5)
SPI1_MISO: BACKPMAN21_CPU (U1.H10), BACKPMAN21_PwrSw (U30.6)
SPI1_MOSI: BACKPMAN21_CPU (U1.F3), BACKPMAN21_PwrSw (U30.4)
SPI1_SCK: BACKPMAN21_CPU (U1.C7), BACKPMAN21_PwrSw (U30.3)
SW_INV_PATH: BACKPMAN21_CPU (U1.J9), BACKPMAN21_PwrSw (U16.1)
SW_MAINS_PATH: BACKPMAN21_CPU (U1.H9), BACKPMAN21_PwrSw (U16.2)
SWD_CLK: BACKPMAN21_CPU (U1.A9), BACKPMAN21_Intfs (R14.1 X5.4)
SWD_DIO: BACKPMAN21_CPU (U1.A10), BACKPMAN21_Intfs (R12.1 X5.2)
SWO: BACKPMAN21_CPU (U1.A7), BACKPMAN21_Intfs (X5.6)
UART1_RTS: BACKPMAN21_CPU (U1.G8), BACKPMAN21_Intfs (U3.5)
UART1_RX: BACKPMAN21_CPU (U1.D4), BACKPMAN21_Intfs (U3.3)
UART1_TX: BACKPMAN21_CPU (U1.C4), BACKPMAN21_Intfs (U3.6)
USB_ID: BACKPMAN21_CPU (U1.D10), BACKPMAN21_Intfs (U11.3 X19.4)
USB_N: BACKPMAN21_CPU (U1.C10), BACKPMAN21_Intfs (U11.1 X19.2)
USB_P: BACKPMAN21_CPU (U1.B10), BACKPMAN21_Intfs (U11.2 X19.3)
USB_VBUS: BACKPMAN21_CPU (U1.C9), BACKPMAN21_Intfs (C30.1 C47.1 L4.2)

## Assembly variants
Base: not fitted C78 Q12 R9 R22 R34 R38 R41 R42